# EAGLE schematic PCB_BALISE_328P (EAGLE 9.5.2)
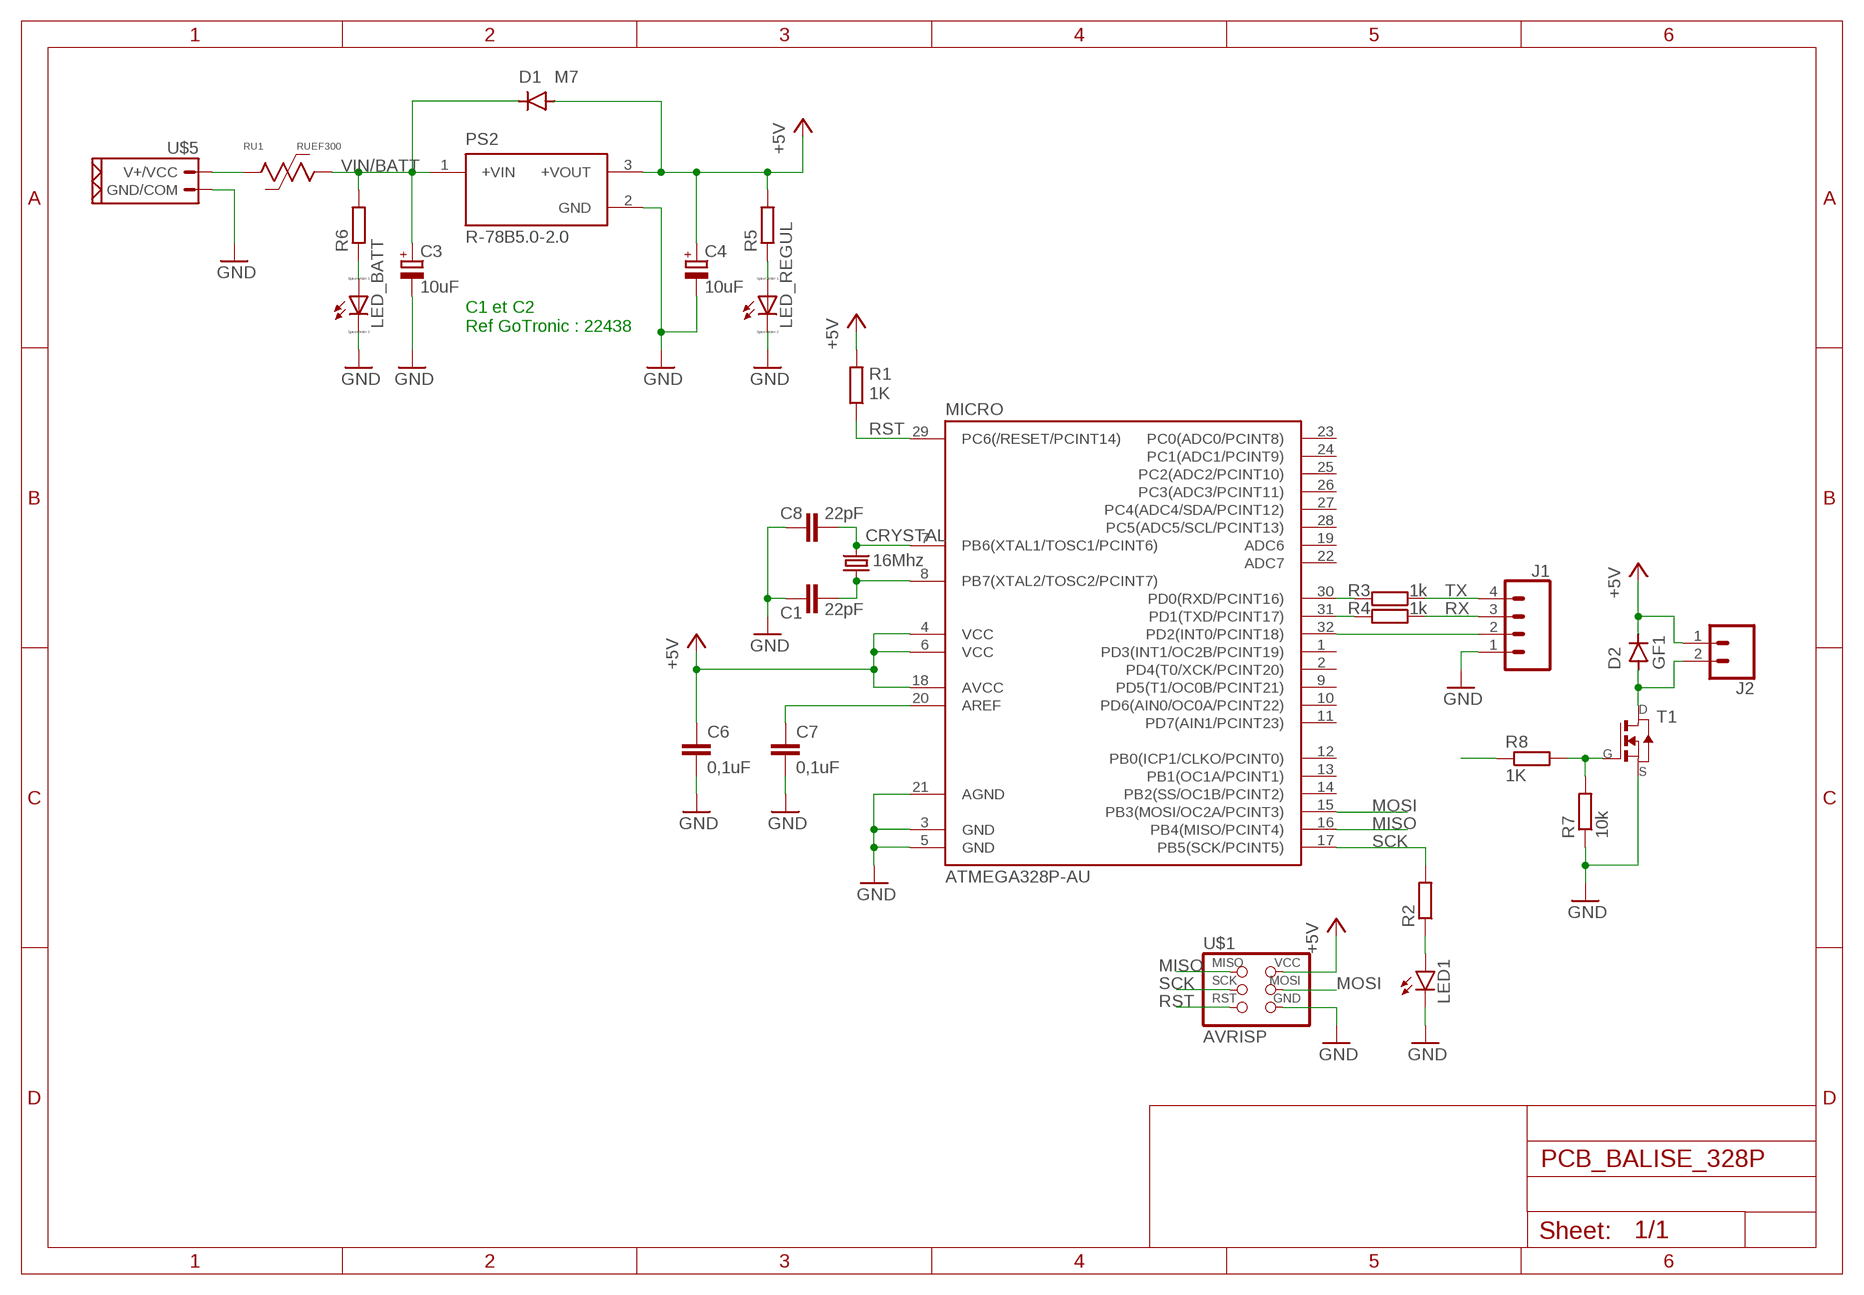
[diagram p0: schematic, sheet 1]

## Parts
C1  22pF  C-EUC1206K  [C1206K]
C3  10uF  CPOL-EU153CLV-0505  [153CLV-0505]
C4  10uF  CPOL-EU153CLV-0505  [153CLV-0505]
C6  0,1uF  C-EUC1206K  [C1206K]
C7  0,1uF  C-EUC1206K  [C1206K]
C8  22pF  C-EUC1206K  [C1206K]
CRYSTAL  16Mhz  CSM-7X-DU  [CSM-7X-DU]
D1  M7  CDBM1100-G  [MINI-SMA]
D2  GF1  [SMA-DO214AC]
J1  CONN_04POLAR  [MOLEX-1X4]
J2  CONN_02POLAR  [MOLEX-1X2]
LED1  LEDSMT1206  [1206]
LED_BATT  LED_E  [LED_1206]
LED_REGUL  LED_E  [LED_1206]
MICRO  ATMEGA328P-AU  ATMEGA48/88/168-AU  [TQFP32-08]
PS2  R-78B5.0-2.0  [CONV_R-78B5.0-2.0]
R1  1K  R-EU_R1206  [R1206]
R2  R-EU_R1206  [R1206]
R3  1k  R-EU_R1206  [R1206]
R4  1k  R-EU_R1206  [R1206]
R5  R-EU_R1206  [R1206]
R6  R-EU_R1206  [R1206]
R7  10k  R-EU_R1206  [R1206]
R8  1K  R-EU_R1206  [R1206]
RU1  RUEF300  [RUEF300]
T1  NMOSFETSOT23  [SOT-23]
U$1  AVRISP  [2X03]
U$5  CONN_02_PUIXT30  [XT30_FEMALE]

## Nets
+5V: C4.+ C6.1 D1.ANODE D2.K(C) J2.1 MICRO.4(VCC) MICRO.6(VCC) MICRO.18(AVCC) PS2.3(+VOUT) R1.2 R5.2 U$1.2(VCC)
GND: C1.1 C3.- C4.- C6.2 C7.2 C8.1 J1.1 LED1.C LED_BATT.C LED_REGUL.C MICRO.3(GND) MICRO.5(GND) MICRO.21(AGND) PS2.2(GND) R7.1 T1.2(S) U$1.6(GND) U$5.P$2(GND/COM)
MISO: MICRO.16(PB4(MISO/PCINT4)) U$1.1(MISO)
MOSI: MICRO.15(PB3(MOSI/OC2A/PCINT3)) U$1.4(MOSI)
N$1: C7.1 MICRO.20(AREF)
N$2: C8.2 CRYSTAL.2 MICRO.7(PB6(XTAL1/TOSC1/PCINT6))
N$3: LED1.A R2.1
N$4: MICRO.30(PD0(RXD/PCINT16)) R3.2
N$5: MICRO.31(PD1(TXD/PCINT17)) R4.2
N$6: J1.2 MICRO.32(PD2(INT0/PCINT18))
N$7: LED_BATT.A R6.1
N$8: RU1.P$1 U$5.P$1(V+/VCC)
N$9: C1.2 CRYSTAL.1 MICRO.8(PB7(XTAL2/TOSC2/PCINT7))
N$10: LED_REGUL.A R5.1
N$11: D2.A J2.2 T1.1(D)
N$12: R7.2 R8.2 T1.3(G)
PUMP: R8.1
RST: MICRO.29(PC6(/RESET/PCINT14)) R1.1 U$1.5(RST)
RX: J1.3 R4.1
SCK: MICRO.17(PB5(SCK/PCINT5)) R2.2 U$1.3(SCK)
TX: J1.4 R3.1
VIN/BATT: C3.+ D1.KATHODE PS2.1(+VIN) R6.2 RU1.P$2
Unconnected: MICRO.1(PD3(INT1/OC2B/PCINT19)) MICRO.2(PD4(T0/XCK/PCINT20)) MICRO.9(PD5(T1/OC0B/PCINT21)) MICRO.10(PD6(AIN0/OC0A/PCINT22)) MICRO.11(PD7(AIN1/PCINT23)) MICRO.12(PB0(ICP1/CLKO/PCINT0)) MICRO.13(PB1(OC1A/PCINT1)) MICRO.14(PB2(SS/OC1B/PCINT2)) MICRO.19(ADC6) MICRO.22(ADC7) MICRO.23(PC0(ADC0/PCINT8)) MICRO.24(PC1(ADC1/PCINT9)) MICRO.25(PC2(ADC2/PCINT10)) MICRO.26(PC3(ADC3/PCINT11)) MICRO.27(PC4(ADC4/SDA/PCINT12)) MICRO.28(PC5(ADC5/SCL/PCINT13))

## Notes on the sheet
- C1 et C2
  Ref GoTronic : 22438

## Library data of the parts
C1 C6-C8 = rcl:C-EU: CAPACITOR, European symbol; SPICEPREFIX: C
C3 C4 = rcl:CPOL-EU: POLARIZED CAPACITOR, European symbol; SPICEPREFIX: C
CRYSTAL = 01_FAB_Hello:CSM-7X-DU: SMD CRYSTAL Source: www.ecsxtal.com .. Crystal 3.6864MHz CSM_7X_DU.PDF; OC_FARNELL: unknown; OC_NEWARK: unknown
D1 = fab:CDBM1100-G: Diode schottky 100V 1A mini-SMA as found in the fablab inventory Reverse Voltage: 100 Volts Forward Current: 1.0 Amp Maximum forward voltage: 0.85 Volts Made by Zaerc.
D2 = diode:GF1: DIODE
J1 = OPENBOT:CONN_04: Multi connection point. Often used as Generic Header-pin footprint for 0.1 inch spaced/style header connections On any of the 0.1 inch spaced packages, you can populate with these: Break Away Headers - Straight <https://www.sparkfun.com/products/116> (PRT-00116) Break Away Male Headers - Right Angle <https://www.sparkfun.com/products/553> (PRT-00553) Female Headers <https://www.sparkfun.com/products/115> (PRT-00115) Break Away Headers - Machine Pin <https://www.sparkfun.com/products/117> (PRT-00117) Break Away Female Headers - Swiss Machine Pin <https://www.sparkfun.com/products/743> (PRT-00743) For SCREWTERMINALS and SPRING TERMINALS visit here: Screw Terimnals on SparkFun.com <https://www.sparkfun.com/search/results?term=Screw+Terminals> (5mm/3.5mm/2.54mm spacing) This device is also useful as a general connection point to wire up your design to another part of your project. Our various solder wires solder well into these plated through hole pads. Hook-Up Wire - Assortment (Stranded, 22 AWG) <https://www.sparkfun.com/products/11375> (PRT-11375) Hook-Up Wire - Assortment (Solid Core, 22 AWG) <https://www.sparkfun.com/products/11367> (PRT-11367) View the entire wire category on our website here <https://www.sparkfun.com/categories/141> Special notes: Molex polarized connector foot print use with SKU : PRT-08231 with associated crimp pins and housings. 1MM SMD Version SKU: PRT-10208 Multi connection point. Often used as Generic Header-pin footprint for 0.1 inch spaced/style header connections On any of the 0.1 inch spaced packages, you can populate with these: Break Away Headers - Straight <https://www.sparkfun.com/products/116> (PRT-00116) Break Away Male Headers - Right Angle <https://www.sparkfun.com/products/553> (PRT-00553) Female Headers <https://www.sparkfun.com/products/115> (PRT-00115) Break Away Headers - Machine Pin <https://www.sparkfun.com/products/117> (PRT-00117) Break Away Female Headers - Swiss Machine Pin <https://www.sparkfun.com/products/743> (PRT-00743) For SCREWTERMINALS and SPRING TERMINALS visit here: Screw Terimnals on SparkFun.com <https://www.sparkfun.com/search/results?term=Screw+Terminals> (5mm/3.5mm/2.54mm spacing) This device is also useful as a general connection point to wire up your design to another part of your project. Our various solder wires solder well into these plated through hole pads. Hook-Up Wire - Assortment (Stranded, 22 AWG) <https://www.sparkfun.com/products/11375> (PRT-11375) Hook-Up Wire - Assortment (Solid Core, 22 AWG) <https://www.sparkfun.com/products/11367> (PRT-11367) View the entire wire category on our website here <https://www.sparkfun.com/categories/141> Special notes: Molex polarized connector foot print use with SKU : PRT-08231 with associated crimp pins and housings. 1MM SMD Version SKU: PRT-10208; PROD_ID: CONN-08186; SF_ID: PRT-08231
J2 = OPENBOT:CONN_02: Multi connection point. Often used as Generic Header-pin footprint for 0.1 inch spaced/style header connections On any of the 0.1 inch spaced packages, you can populate with these: Break Away Headers - Straight <https://www.sparkfun.com/products/116> (PRT-00116) Break Away Male Headers - Right Angle <https://www.sparkfun.com/products/553> (PRT-00553) Female Headers <https://www.sparkfun.com/products/115> (PRT-00115) Break Away Headers - Machine Pin <https://www.sparkfun.com/products/117> (PRT-00117) Break Away Female Headers - Swiss Machine Pin <https://www.sparkfun.com/products/743> (PRT-00743) For SCREWTERMINALS and SPRING TERMINALS visit here: Screw Terimnals on SparkFun.com <https://www.sparkfun.com/search/results?term=Screw+Terminals> (5mm/3.5mm/2.54mm spacing) This device is also useful as a general connection point to wire up your design to another part of your project. Our various solder wires solder well into these plated through hole pads. Hook-Up Wire - Assortment (Stranded, 22 AWG) <https://www.sparkfun.com/products/11375> (PRT-11375) Hook-Up Wire - Assortment (Solid Core, 22 AWG) <https://www.sparkfun.com/products/11367> (PRT-11367) View the entire wire category on our website here <https://www.sparkfun.com/categories/141> Special notes: Molex polarized connector foot print use with: PRT-08233 with associated crimp pins and housings. 2.54_SCREWTERM for use with PRT-10571. 3.5mm Screw Terminal footprints for PRT-08084 5mm Screw Terminal footprints for use with PRT-08432 Multi connection point. Often used as Generic Header-pin footprint for 0.1 inch spaced/style header connections On any of the 0.1 inch spaced packages, you can populate with these: Break Away Headers - Straight <https://www.sparkfun.com/products/116> (PRT-00116) Break Away Male Headers - Right Angle <https://www.sparkfun.com/products/553> (PRT-00553) Female Headers <https://www.sparkfun.com/products/115> (PRT-00115) Break Away Headers - Machine Pin <https://www.sparkfun.com/products/117> (PRT-00117) Break Away Female Headers - Swiss Machine Pin <https://www.sparkfun.com/products/743> (PRT-00743) For SCREWTERMINALS and SPRING TERMINALS visit here: Screw Terimnals on SparkFun.com <https://www.sparkfun.com/search/results?term=Screw+Terminals> (5mm/3.5mm/2.54mm spacing) This device is also useful as a general connection point to wire up your design to another part of your project. Our various solder wires solder well into these plated through hole pads. Hook-Up Wire - Assortment (Stranded, 22 AWG) <https://www.sparkfun.com/products/11375> (PRT-11375) Hook-Up Wire - Assortment (Solid Core, 22 AWG) <https://www.sparkfun.com/products/11367> (PRT-11367) View the entire wire category on our website here <https://www.sparkfun.com/categories/141> Special notes: Molex polarized connector foot print use with: PRT-08233 with associated crimp pins and housings. 2.54_SCREWTERM for use with PRT-10571. 3.5mm Screw Terminal footprints for PRT-08084 5mm Screw Terminal footprints for use with PRT-08432; SF_ID: PRT-09918
LED1 = led:LED: LED OSRAM: - CHIPLED LG R971, LG N971, LY N971, LG Q971, LY Q971, LO R971, LY R971 LH N974, LH R974 LS Q976, LO Q976, LY Q976 LO Q996 - Hyper CHIPLED LW Q18S LB Q993, LB Q99A, LB R99A - SideLED LS A670, LO A670, LY A670, LG A670, LP A670 LB A673, LV A673, LT A673, LW A673 LH A674 LY A675 LS A676, LA A676, LO A676, LY A676, LW A676 LS A679, LY A679, LG A679 - Hyper Micro SIDELED® LS Y876, LA Y876, LO Y876, LY Y876 LT Y87S - SmartLED LW L88C, LW L88S LB L89C, LB L89S, LG L890 LS L89K, LO L89K, LY L89K LS L896, LA L896, LO L896, LY L896 - TOPLED LS T670, LO T670, LY T670, LG T670, LP T670 LSG T670, LSP T670, LSY T670, LOP T670, LYG T670 LG T671, LOG T671, LSG T671 LB T673, LV T673, LT T673, LW T673 LH T674 LS T676, LA T676, LO T676, LY T676, LB T676, LH T676, LSB T676, LW T676 LB T67C, LV T67C, LT T67C, LS T67K, LO T67K, LY T67K, LW E67C LS E67B, LA E67B, LO E67B, LY E67B, LB E67C, LV E67C, LT E67C LW T67C LS T679, LY T679, LG T679 LS T770, LO T770, LY T770, LG T770, LP T770 LB T773, LV T773, LT T773, LW T773 LH T774 LS E675, LA E675, LY E675, LS T675 LS T776, LA T776, LO T776, LY T776, LB T776 LHGB T686 LT T68C, LB T68C - Hyper Mini TOPLED® LB M676 - Mini TOPLED Santana® LG M470 LS M47K, LO M47K, LY M47K Source: http://www.osram.convergy.de LUXEON: - LUMILED® LXK2-PW12-R00, LXK2-PW12-S00, LXK2-PW14-U00, LXK2-PW14-V00 LXK2-PM12-R00, LXK2-PM12-S00, LXK2-PM14-U00 LXK2-PE12-Q00, LXK2-PE12-R00, LXK2-PE12-S00, LXK2-PE14-T00, LXK2-PE14-U00 LXK2-PB12-K00, LXK2-PB12-L00, LXK2-PB12-M00, LXK2-PB14-N00, LXK2-PB14-P00, LXK2-PB14-Q00 LXK2-PR12-L00, LXK2-PR12-M00, LXK2-PR14-Q00, LXK2-PR14-R00 LXK2-PD12-Q00, LXK2-PD12-R00, LXK2-PD12-S00 LXK2-PH12-R00, LXK2-PH12-S00 LXK2-PL12-P00, LXK2-PL12-Q00, LXK2-PL12-R00 Source: www.luxeon.com KINGBRIGHT: KA-3528ASYC Source: www.kingbright.com
LED_BATT LED_REGUL = eagle-ltspice:LED_E: LED Source: http://www.osram.convergy.de Source: www.luxeon.com Source: www.kingbright.com; SPICEMODEL: NONE; SPICEPREFIX: D; SPICETYPE: diode
MICRO = atmega8:ATMEGA48/88/168
PS2 = OPENBOT:R-78B5.0-2.0: 2.0 Amp SIP3 Single Output; AVAILABILITY: Unavailable; DESCRIPTION: 2A DC/DC-Converter 'INNOLINE' SIP3 reg; MF: Recom Power; MP: R-78B5.0-2.0; PACKAGE: SIP-3 Recom Power; PRICE: None
R1-R8 = rcl:R-EU_: RESISTOR, European symbol; SPICEPREFIX: R
RU1 = OPENBOT:RUEF300
T1 = fab:NMOSFET: MOS FET
U$1 = fab:AVRISP
U$5 = OPENBOT:CONN_02_PUI